# Altium project CCD_CAM_BOARD.PrjPcb (part 1 of 4)
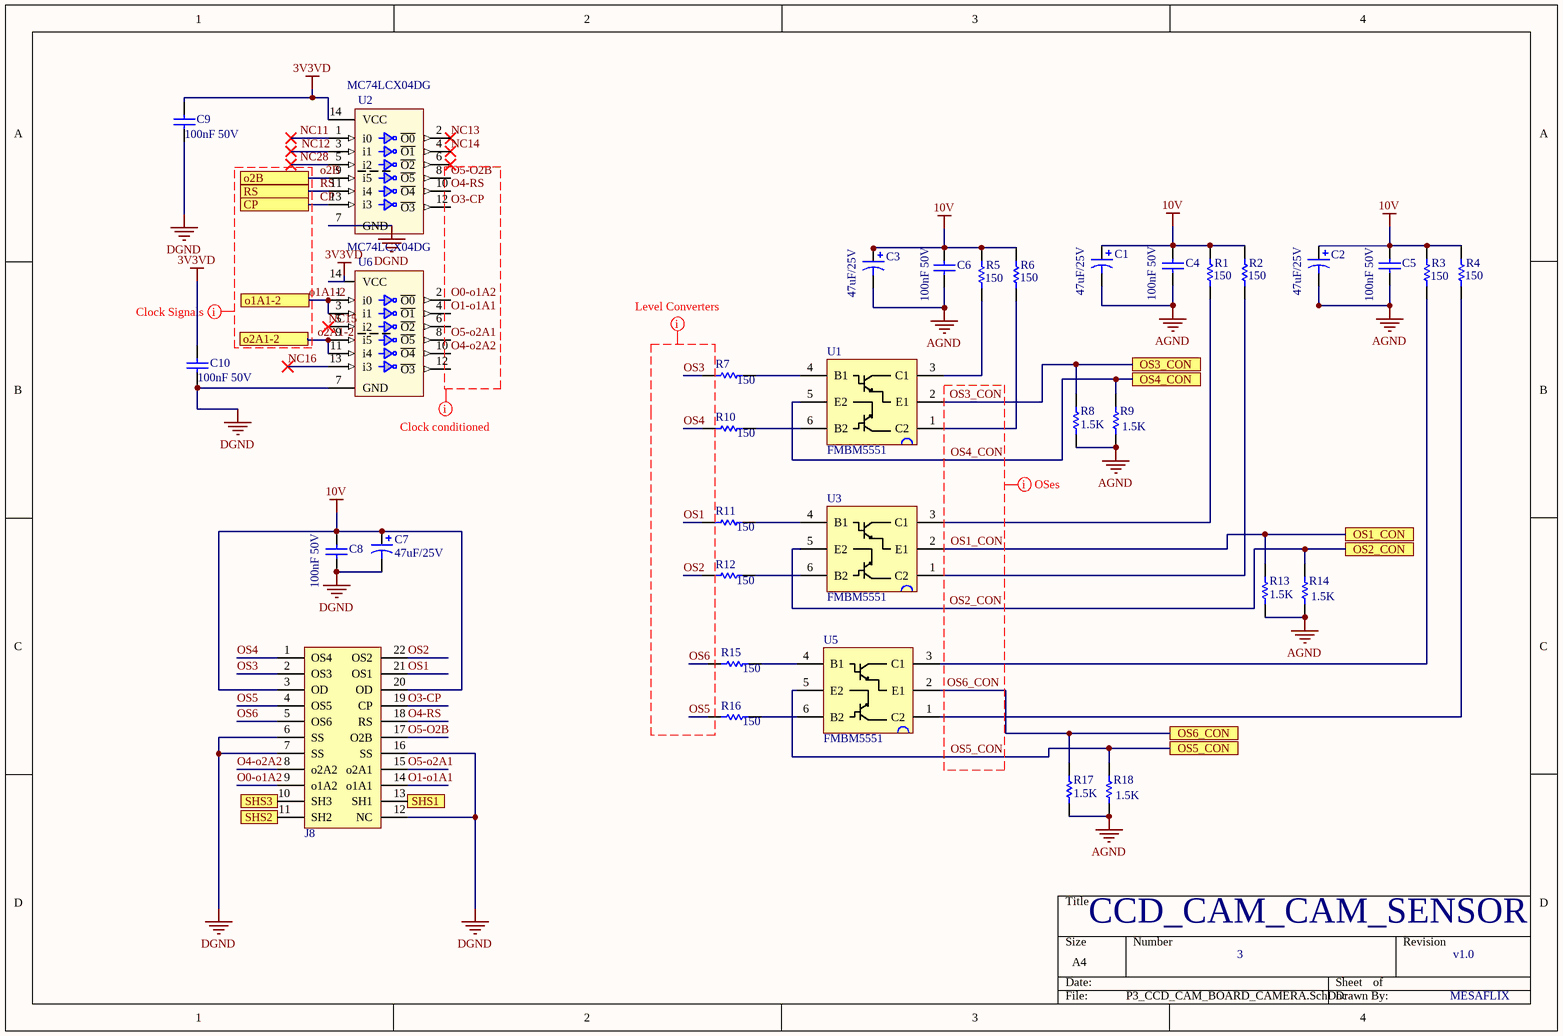
[diagram p0: P3_CCD_CAM_BOARD_CAMERA.SchDoc]
7 sheets, 290 parts. Net scope: flat (ports and power ports of the same name join across sheets).
Board file: CCD_CAM_BOARD_PCB_v3.PcbDoc
Sheets:
  P3_CCD_CAM_BOARD_CAMERA.SchDoc
  P2_CCD_CAM_BOARD_POWER.SchDoc
  P4_CCD_CAM_BOARD_MCU.SchDoc
  P8_CCD_CAM_BOARD_COMM.SchDoc
  P5_CCD_CAM_BOARD_AFE.SchDoc
  P6_CCD_CAM_BOARD_HDMI.SchDoc
  P7_CCD_CAM_BOARD_MYIR.SchDoc

## Sheet P3_CCD_CAM_BOARD_CAMERA.SchDoc
size A4

### Parts
C1  value 47uF/25V  [1206 (3216)]  (hidden comment: Cap)
C2  value 47uF/25V  [1206 (3216)]  (hidden comment: Cap)
C3  value 47uF/25V  [1206 (3216)]  (hidden comment: Cap)
C4  100nF 50V  [CAP0603]
C5  100nF 50V  [CAP0603]
C6  100nF 50V  [CAP0603]
C7  value 47uF/25V  [1206 (3216)]  (hidden comment: Cap)
C8  100nF 50V  [CAP0603]
C9  100nF 50V  [CAP0603]
C10  100nF 50V  [CAP0603]
J8  CONN  [CCD_SENSOR_PIN]  (value not drawn)
R1  value 150  [0402 (1005)]  (hidden comment: Res Semi)
R2  value 150  [0402 (1005)]  (hidden comment: Res Semi)
R3  value 150  [0402 (1005)]  (hidden comment: Res Semi)
R4  value 150  [0402 (1005)]  (hidden comment: Res Semi)
R5  value 150  [0402 (1005)]  (hidden comment: Res Semi)
R6  value 150  [0402 (1005)]  (hidden comment: Res Semi)
R7  value 150  [0402 (1005)]  (hidden comment: Res Semi)
R8  value 1.5K  [0402 (1005)]  (hidden comment: Res Semi)
R9  value 1.5K  [0402 (1005)]  (hidden comment: Res Semi)
R10  value 150  [0402 (1005)]  (hidden comment: Res Semi)
R11  value 150  [0402 (1005)]  (hidden comment: Res Semi)
R12  value 150  [0402 (1005)]  (hidden comment: Res Semi)
R13  value 1.5K  [0402 (1005)]  (hidden comment: Res Semi)
R14  value 1.5K  [0402 (1005)]  (hidden comment: Res Semi)
R15  value 150  [0402 (1005)]  (hidden comment: Res Semi)
R16  value 150  [0402 (1005)]  (hidden comment: Res Semi)
R17  value 1.5K  [0402 (1005)]  (hidden comment: Res Semi)
R18  value 1.5K  [0402 (1005)]  (hidden comment: Res Semi)
U1  FMBM5551  [SOT95P285X140-6N]
U2  MC74LCX04DG  [SOIC127P600X175-14N]
U3  FMBM5551  [SOT95P285X140-6N]
U5  FMBM5551  [SOT95P285X140-6N]
U6  MC74LCX04DG  [SOIC127P600X175-14N]

### Ports
CP, o1A1-2, o2A1-2, o2B, OS1_CON, OS2_CON, OS3_CON, OS4_CON, OS5_CON, OS6_CON, RS, SHS1, SHS2, SHS3

### Nets
3V3VD: C9.2 C10.2 U2.14(VCC) U6.14(VCC)  [project net VDD_3V3]
10V: C1.1 C2.1 C3.1 C4.2 C5.2 C6.2 C7.1 C8.2 J8.3(OD) J8.20(OD) R1.1 R2.1 R3.1 R4.1 R5.1 R6.1
AGND: C1.2 C2.2 C3.2 C4.1 C5.1 C6.1 R8.2 R9.1 R13.2 R14.1 R17.2 R18.1
DGND: C7.2 C8.1 C9.1 C10.1 J8.6(SS) J8.7(SS) J8.12(NC) J8.16(SS) U2.7(GND) U6.7(GND)
CP: U2.13(i3) ; port CP
NC11: U2.1(i0)
NC12: U2.3(i1)
NC13: U2.2(~{O0})
NC14: U2.4(~{O1})
NC15: U6.5(i2)
NC16: U6.13(i3)
NC28: U2.5(i2)
O0-o1A2: J8.9(o1A2) U6.2(~{O0})
O1-o1A1: J8.14(o1A1) U6.4(~{O1})
o1A1-2: U6.1(i0) U6.3(i1) ; port o1A1-2
o2A1-2: U6.9(i5) U6.11(i4) ; port o2A1-2
o2B: U2.9(i5) ; port o2B
O3-CP: J8.19(CP) U2.12(~{O3})
O4-o2A2: J8.8(o2A2) U6.10(~{O4})
O4-RS: J8.18(RS) U2.10(~{O4})
O5-o2A1: J8.15(o2A1) U6.8(~{O5})
O5-O2B: J8.17(O2B) U2.8(~{O5})
OS1: J8.21(OS1) R11.1
OS1_CON: R13.1 U3.2(E1) ; port OS1_CON
OS2: J8.22(OS2) R12.1
OS2_CON: R14.2 U3.5(E2) ; port OS2_CON
OS3: J8.2(OS3) R7.1
OS3_CON: R8.1 U1.2(E1) ; port OS3_CON
OS4: J8.1(OS4) R10.1
OS4_CON: R9.2 U1.5(E2) ; port OS4_CON
OS5: J8.4(OS5) R16.1
OS5_CON: R18.2 U5.5(E2) ; port OS5_CON
OS6: J8.5(OS6) R15.1
OS6_CON: R17.1 U5.2(E1) ; port OS6_CON
RS: U2.11(i4) ; port RS
SH1: J8.13(SH1) ; port SHS1
NetJ8_10: J8.10(SH3) ; port SHS3
NetJ8_11: J8.11(SH2) ; port SHS2
NetR1_2: R1.2 U3.3(C1)
NetR2_2: R2.2 U3.1(C2)
NetR3_2: R3.2 U5.3(C1)
NetR4_2: R4.2 U5.1(C2)
NetR5_2: R5.2 U1.3(C1)
NetR6_2: R6.2 U1.1(C2)
NetR7_2: R7.2 U1.4(B1)
NetR10_2: R10.2 U1.6(B2)
NetR11_2: R11.2 U3.4(B1)
NetR12_2: R12.2 U3.6(B2)
NetR15_2: R15.2 U5.4(B1)
NetR16_2: R16.2 U5.6(B2)

Not connected (* = marked no-connect by the designer): U2 6(~{O2})*; U6 6(~{O2}) 12(~{O3})

### Layout directives
rule Matched Net Lengths [Tolerance = 0.05mm]; net class level_converters: OS1, OS2, OS3, OS4, OS5, OS6
rule Matched Net Lengths [Tolerance = 0.05mm]; net class clock_conditioned: O0-o1A2, O1-o1A1, O3-CP, O4-o2A2, O4-RS, O5-o2A1, O5-O2B
rule Matched Net Lengths [Tolerance = 0.05mm]; net class oses: OS1_CON, OS2_CON, OS3_CON, OS4_CON, OS5_CON, OS6_CON
rule Matched Net Lengths [Tolerance = 0.05mm]; net class clock_signals: o1A1-2

### Notes on the sheet
- CCD_CAM_CAM_SENSOR
- 3
- v1.0
- MESAFLIX

### Library data of the parts
C1-C3 C7 = Cap Chip Pol: GRM31CR61E476ME44L / Chip capacitor can be polarized or not, depending on the chip type.  Verify Capacitance and package size before placing.; Mfr Part #: GRM31CR61E476ME44L
C4-C6 C8-C10 = CAP0603_100nF: CAP CER 0.1UF 50V X7R 0603; P/N: C0603C104K5RACTU; Order Code: DIGI : 399-5089-1-ND; Value: 100nF 50V
J8 = CCD_SENSOR_PIN: 11x2 Connector
R1-R7 R10-R12 R15 R16 = Res Semi: Semiconductor Resistor; Mfr Part #: RC0402FR-07150RL
R8 R9 R13 R14 R17 R18 = Res Semi: Semiconductor Resistor; Mfr Part #: RC0402FR-071K5L
U2 U6 = MC74LCX04DG: Inverter IC 6 Channel 14-SOIC; Value: *

## Sheet P2_CCD_CAM_BOARD_POWER.SchDoc
size A3
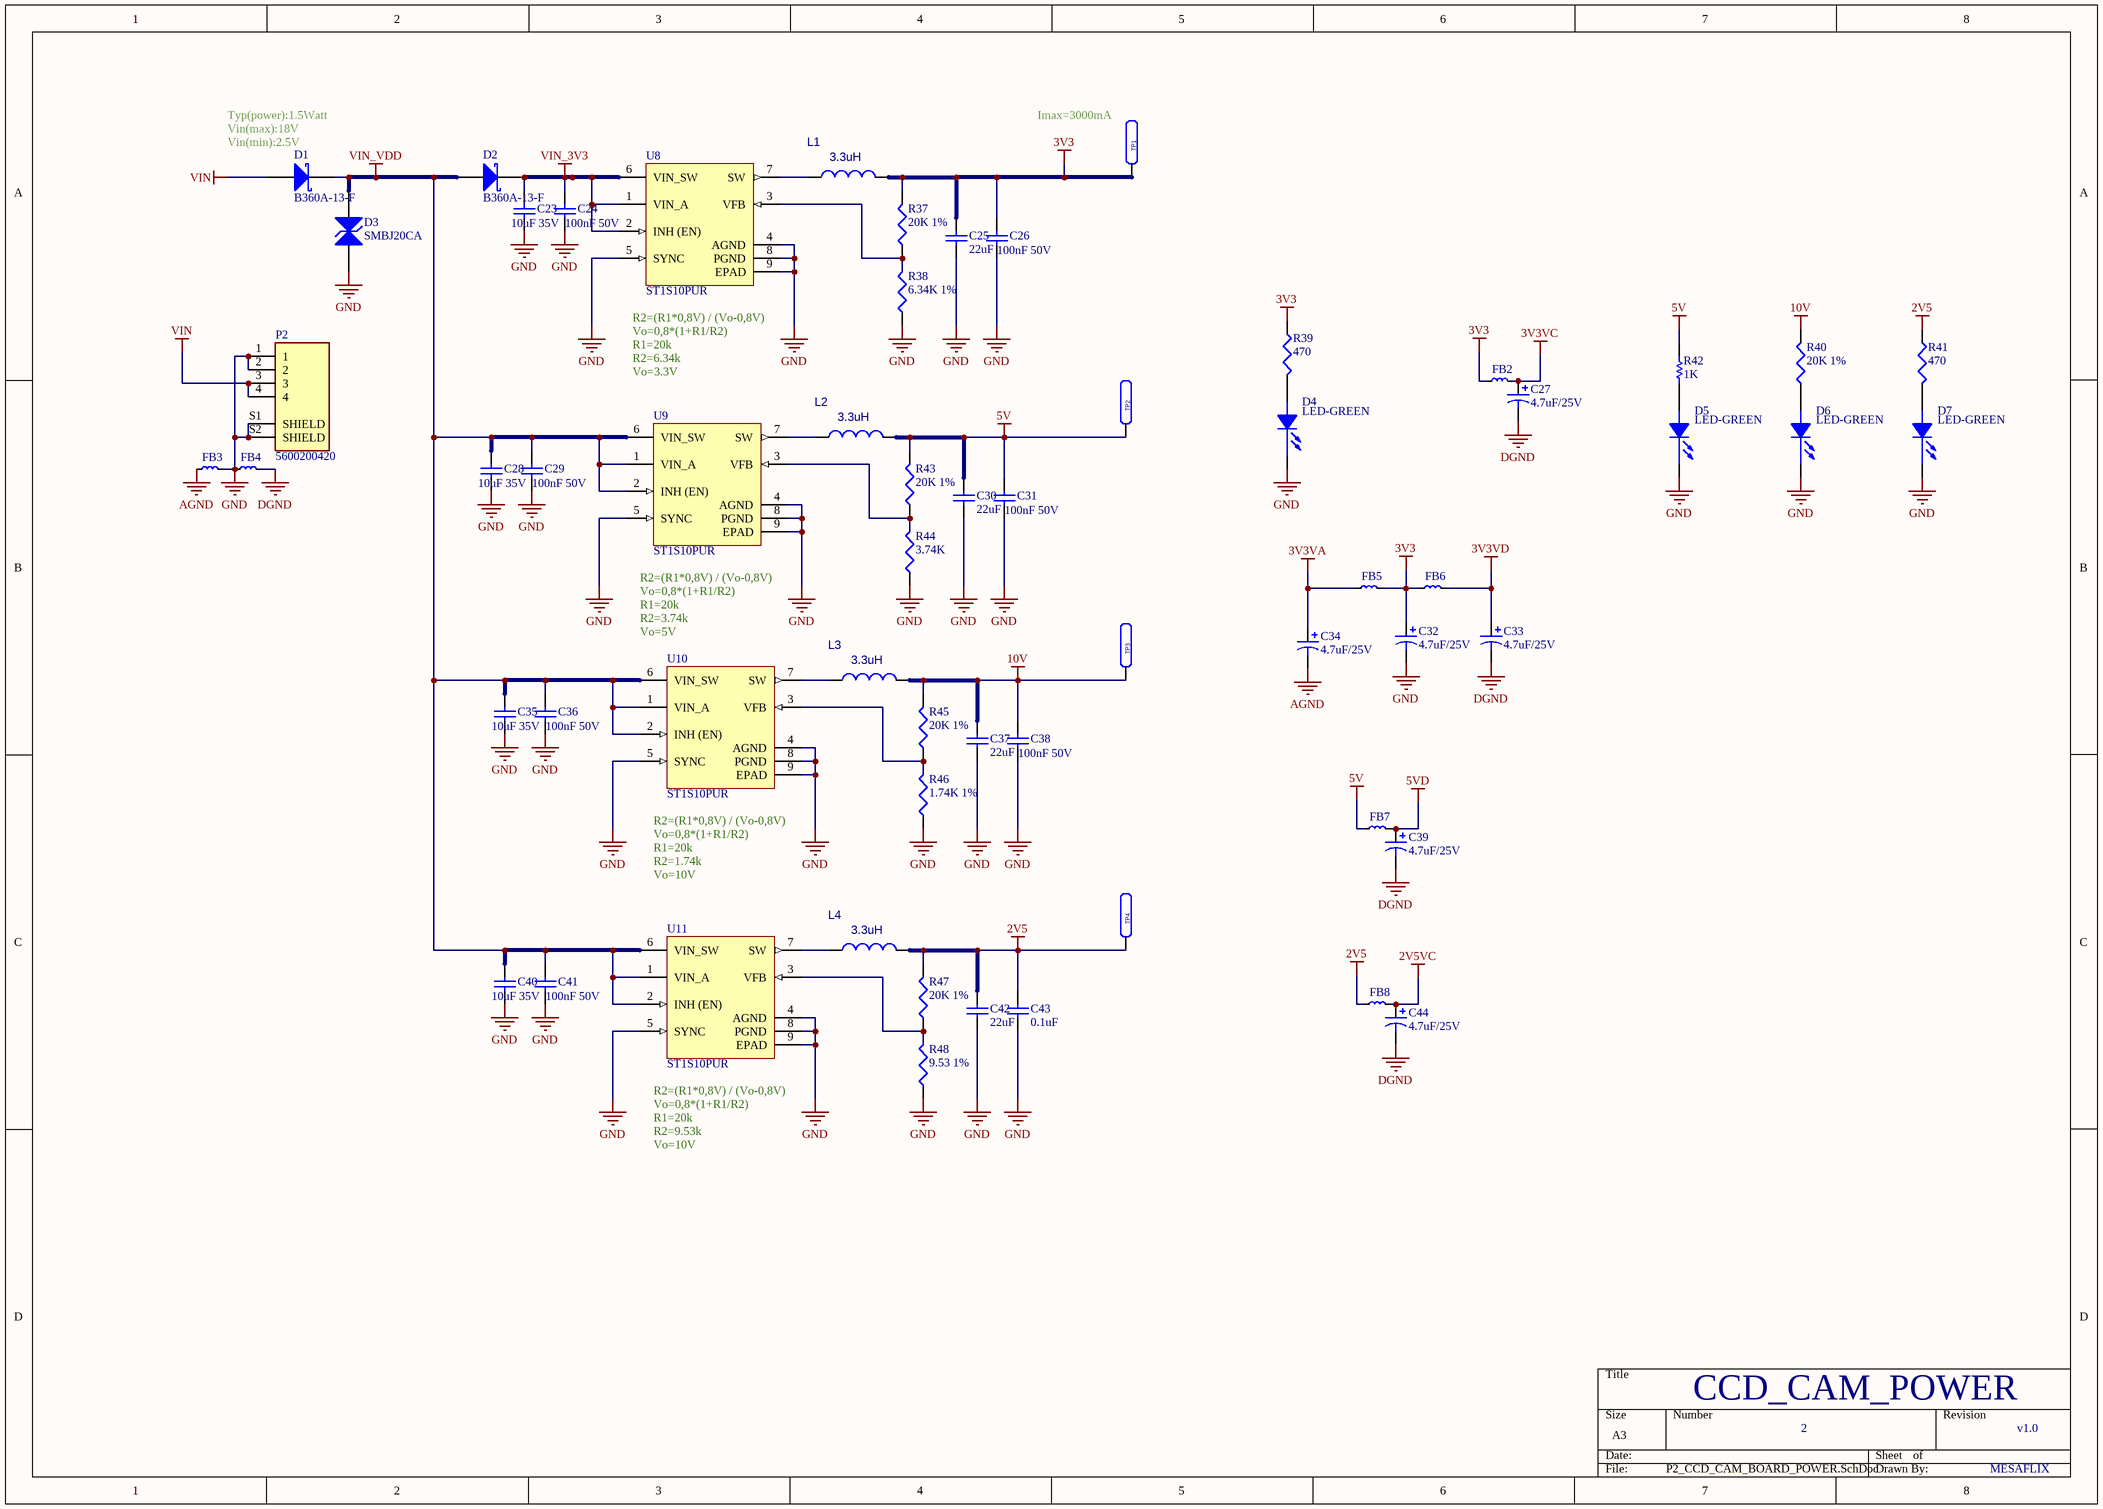
[diagram p1: P2_CCD_CAM_BOARD_POWER.SchDoc]

### Parts
C23  10uF 35V  [C 0603(1608)x0.8]
C24  100nF 50V  [CAP0603]
C25  22uF  [C 0603(1608)x0.8]
C26  100nF 50V  [CAP0603]
C27  value 4.7uF/25V  [0805 (2012)]  (hidden comment: GRM219R61E475KA73D)
C28  10uF 35V  [C 0603(1608)x0.8]
C29  100nF 50V  [CAP0603]
C30  22uF  [C 0603(1608)x0.8]
C31  100nF 50V  [CAP0603]
C32  value 4.7uF/25V  [0805 (2012)]  (hidden comment: GRM219R61E475KA73D)
C33  value 4.7uF/25V  [0805 (2012)]  (hidden comment: GRM219R61E475KA73D)
C34  value 4.7uF/25V  [0805 (2012)]  (hidden comment: GRM219R61E475KA73D)
C35  10uF 35V  [C 0603(1608)x0.8]
C36  100nF 50V  [CAP0603]
C37  22uF  [C 0603(1608)x0.8]
C38  100nF 50V  [CAP0603]
C39  value 4.7uF/25V  [0805 (2012)]  (hidden comment: GRM219R61E475KA73D)
C40  10uF 35V  [C 0603(1608)x0.8]
C41  100nF 50V  [CAP0603]
C42  22uF  [C 0603(1608)x0.8]
C43  0.1uF  [C 0402(1005)x0.5]
C44  value 4.7uF/25V  [0805 (2012)]  (hidden comment: GRM219R61E475KA73D)
D1  B360A-13-F  [DIOD-B360A_V]
D2  B360A-13-F  [DIOD-B360A_V]
D3  SMBJ20CA  [FAIR-DO-214AA-A-2_V]
D4  LED-GREEN  [LED_0603]
D5  LED-GREEN  [LED_0603]
D6  LED-GREEN  [LED_0603]
D7  LED-GREEN  [LED_0603]
FB2  NFZ2MSD600SN10L  [FB0806]  (value not drawn)
FB3  NFZ2MSD600SN10L  [FB0806]  (value not drawn)
FB4  NFZ2MSD600SN10L  [FB0806]  (value not drawn)
FB5  NFZ2MSD600SN10L  [FB0806]  (value not drawn)
FB6  NFZ2MSD600SN10L  [FB0806]  (value not drawn)
FB7  NFZ2MSD600SN10L  [FB0806]  (value not drawn)
FB8  NFZ2MSD600SN10L  [FB0806]  (value not drawn)
L1  3.3uH  [IFSC1515AHER]
L2  3.3uH  [IFSC1515AHER]
L3  3.3uH  [IFSC1515AHER]
L4  3.3uH  [IFSC1515AHER]
P2  5600200420  [MOLEX_5600200420_3D]
R37  20K 1%  [R 0402(1005)]
R38  6.34K 1%  [R 0402(1005)]
R39  470  [R 0402(1005)]
R40  20K 1%  [R 0402(1005)]
R41  470  [R 0402(1005)]
R42  value 1K  [CAP_RES_1608_0603]  (hidden comment: RES_1K_0603)
R43  20K 1%  [R 0402(1005)]
R44  3.74K  [R 0402(1005)]
R45  20K 1%  [R 0402(1005)]
R46  1.74K 1%  [R 0402(1005)]
R47  20K 1%  [R 0402(1005)]
R48  9.53 1%  [R 0402(1005)]
TP1  3V7  [LTPT35C49P]  (value not drawn)
TP2  3V7  [LTPT35C49P]  (value not drawn)
TP3  3V7  [LTPT35C49P]  (value not drawn)
TP4  3V7  [LTPT35C49P]  (value not drawn)
U8  ST1S10PUR  [DFN(4x4)_N]
U9  ST1S10PUR  [DFN(4x4)_N]
U10  ST1S10PUR  [DFN(4x4)_N]
U11  ST1S10PUR  [DFN(4x4)_N]

### Nets
2V5: C42.1 C43.2 FB8.1 L4.2 R41.1 R47.2 TP4.1
2V5VC: C44.1 FB8.2
3V3: C25.1 C26.2 C32.1 FB2.1 FB5.2 FB6.1 L1.2 R37.2 R39.1 TP1.1
3V3VA: C34.1 FB5.1
3V3VC: C27.1 FB2.2
3V3VD: C33.1 FB6.2  [project net VDD_3V3]
5V: C30.1 C31.2 FB7.1 L2.2 R42.1 R43.2 TP2.1
5VD: C39.1 FB7.2  [project net VDD_5V]
10V: C37.1 C38.2 L3.2 R40.2 R45.2 TP3.1
AGND: C34.2 FB3.1
DGND: C27.2 C33.2 C39.2 C44.2 FB4.2
GND: C23.2 C24.1 C25.2 C26.1 C28.2 C29.1 C30.2 C31.1 C32.2 C35.2 C36.1 C37.2 C38.1 C40.2 C41.1 C42.2 C43.1 D3.1(A) D4.2(CATHODE) D5.2(CATHODE) D6.2(CATHODE) D7.2(CATHODE) FB3.2 FB4.1 P2.1 P2.2 P2.S1(SHIELD) P2.S2(SHIELD) R38.1 R44.1 R46.1 R48.1 U8.4(AGND) U8.5(SYNC) U8.8(PGND) U8.9(EPAD) U9.4(AGND) U9.5(SYNC) U9.8(PGND) U9.9(EPAD) U10.4(AGND) U10.5(SYNC) U10.8(PGND) U10.9(EPAD) U11.4(AGND) U11.5(SYNC) U11.8(PGND) U11.9(EPAD)
VIN: D1.1(A) P2.3 P2.4
VIN_3V3: C23.1 C24.2 D2.2(K) U8.1(VIN_A) U8.2(INH_(EN)) U8.6(VIN_SW)
VIN_VDD: C28.1 C29.2 C35.1 C36.2 C40.1 C41.2 D1.2(K) D2.1(A) D3.2(A) U9.1(VIN_A) U9.2(INH_(EN)) U9.6(VIN_SW) U10.1(VIN_A) U10.2(INH_(EN)) U10.6(VIN_SW) U11.1(VIN_A) U11.2(INH_(EN)) U11.6(VIN_SW)
NetD4_1: D4.1(ANODE) R39.2
NetD5_1: D5.1(ANODE) R42.2
NetD6_1: D6.1(ANODE) R40.1
NetD7_1: D7.1(ANODE) R41.2
NetL1_1: L1.1 U8.7(SW)
NetL2_1: L2.1 U9.7(SW)
NetL3_1: L3.1 U10.7(SW)
NetL4_1: L4.1 U11.7(SW)
NetR37_1: R37.1 R38.2 U8.3(VFB)
NetR43_1: R43.1 R44.2 U9.3(VFB)
NetR45_1: R45.1 R46.2 U10.3(VFB)
NetR47_1: R47.1 R48.2 U11.3(VFB)

### Notes on the sheet
- (near D1) Vin(max):18V
- Typ(power):1.5Watt
- (near D1) Vin(min):2.5V
- (near TP1) Imax=3000mA
- Vo=0,8*(1+R1/R2)
- R1=20k
- R2=6.34k
- Vo=3.3V
- (near U8) R2=(R1*0,8V) / (Vo-0,8V)
- (near U9) R2=(R1*0,8V) / (Vo-0,8V)
- R2=3.74k
- (near U10) Vo=5V
- (near U10) R2=(R1*0,8V) / (Vo-0,8V)
- R2=1.74k
- Vo=10V
- (near U11) R2=(R1*0,8V) / (Vo-0,8V)
- R2=9.53k
- CCD_CAM_POWER
- 2
- v1.0
- MESAFLIX